# EAGLE design nixie_temp_clock (EAGLE 9.1.1)
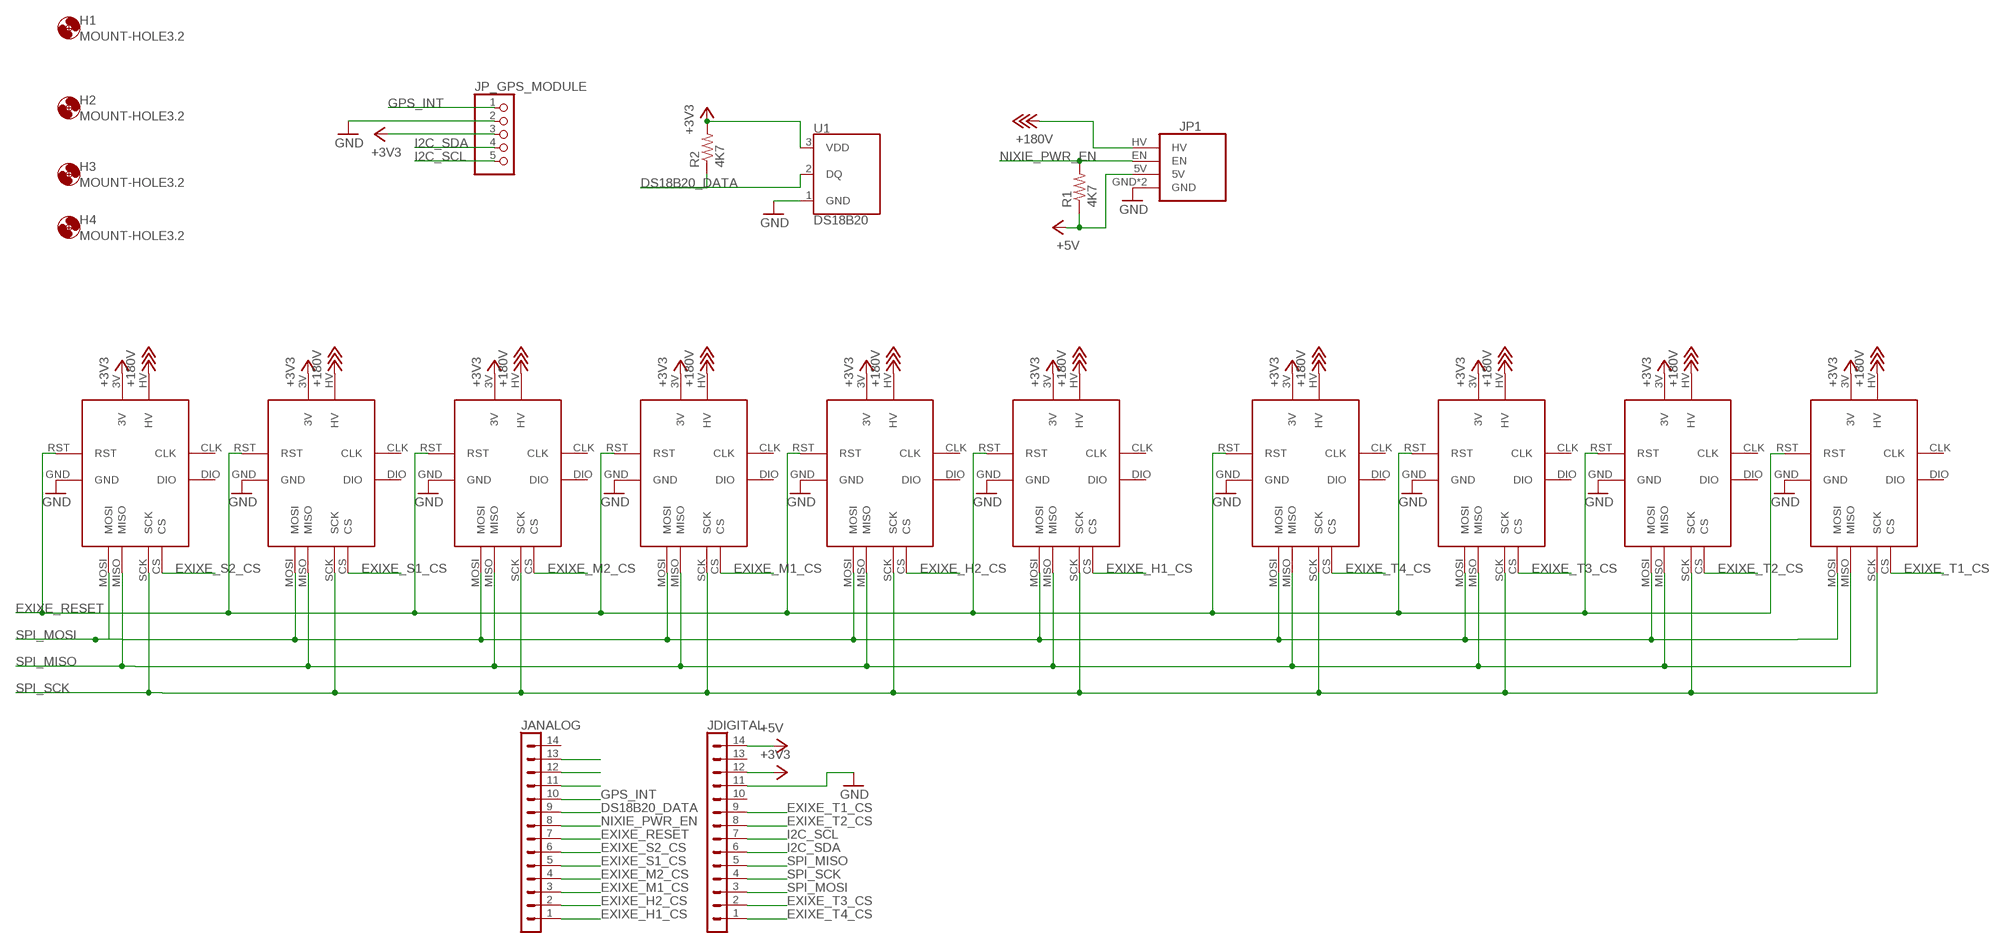
[diagram p0: schematic, sheet 1]

## Parts
EXIXE_H1  EXIXE_MODULE_EXIXE  [EXIXE_MODULE_EXIXE_PAC]
EXIXE_H2  EXIXE_MODULE_EXIXE  [EXIXE_MODULE_EXIXE_PAC]
EXIXE_M1  EXIXE_MODULE_EXIXE  [EXIXE_MODULE_EXIXE_PAC]
EXIXE_M2  EXIXE_MODULE_EXIXE  [EXIXE_MODULE_EXIXE_PAC]
EXIXE_S1  EXIXE_MODULE_EXIXE  [EXIXE_MODULE_EXIXE_PAC]
EXIXE_S2  EXIXE_MODULE_EXIXE  [EXIXE_MODULE_EXIXE_PAC]
EXIXE_T1  EXIXE_MODULE_EXIXE  [EXIXE_MODULE_EXIXE_PAC]
EXIXE_T2  EXIXE_MODULE_EXIXE  [EXIXE_MODULE_EXIXE_PAC]
EXIXE_T3  EXIXE_MODULE_EXIXE  [EXIXE_MODULE_EXIXE_PAC]
EXIXE_T4  EXIXE_MODULE_EXIXE  [EXIXE_MODULE_EXIXE_PAC]
H1  MOUNT-HOLE3.2  [3,2]
H2  MOUNT-HOLE3.2  [3,2]
H3  MOUNT-HOLE3.2  [3,2]
H4  MOUNT-HOLE3.2  [3,2]
JANALOG  ARDUINO-CONNECTORS_PINHD-1X14-SMTH  [ARDUINO-CONNECTORS_1X14]
JDIGITAL  ARDUINO-CONNECTORS_PINHD-1X14-SMTH  [ARDUINO-CONNECTORS_1X14]
JP1  EBAY_MODULETAOBAO  [TAOBAO_PKG]
JP_GPS_MODULE  PINHD-1X5  [1X05]
R1  4K7  R-US_0207/15  [0207/15]
R2  4K7  R-US_0207/15  [0207/15]
U1  DS18B20  [TO-92-AMMO]

## Nets
+3V3: EXIXE_H1.3V EXIXE_H2.3V EXIXE_M1.3V EXIXE_M2.3V EXIXE_S1.3V EXIXE_S2.3V EXIXE_T1.3V EXIXE_T2.3V EXIXE_T3.3V EXIXE_T4.3V JDIGITAL.12 JP_GPS_MODULE.3 R2.2 U1.3(VDD)
+5V: JDIGITAL.14 JP1.5V R1.1
+180V: EXIXE_H1.HV EXIXE_H2.HV EXIXE_M1.HV EXIXE_M2.HV EXIXE_S1.HV EXIXE_S2.HV EXIXE_T1.HV EXIXE_T2.HV EXIXE_T3.HV EXIXE_T4.HV JP1.HV
DS18B20_DATA: JANALOG.9 R2.1 U1.2(DQ)
EXIXE_H1_CS: EXIXE_S2.CS JANALOG.1
EXIXE_H2_CS: EXIXE_S1.CS JANALOG.2
EXIXE_M1_CS: EXIXE_M2.CS JANALOG.3
EXIXE_M2_CS: EXIXE_M1.CS JANALOG.4
EXIXE_RESET: EXIXE_H1.RST EXIXE_H2.RST EXIXE_M1.RST EXIXE_M2.RST EXIXE_S1.RST EXIXE_S2.RST EXIXE_T1.RST EXIXE_T2.RST EXIXE_T3.RST EXIXE_T4.RST JANALOG.7
EXIXE_S1_CS: EXIXE_H2.CS JANALOG.5
EXIXE_S2_CS: EXIXE_H1.CS JANALOG.6
EXIXE_T1_CS: EXIXE_T4.CS JDIGITAL.9
EXIXE_T2_CS: EXIXE_T3.CS JDIGITAL.8
EXIXE_T3_CS: EXIXE_T2.CS JDIGITAL.2
EXIXE_T4_CS: EXIXE_T1.CS JDIGITAL.1
GND: EXIXE_H1.GND EXIXE_H2.GND EXIXE_M1.GND EXIXE_M2.GND EXIXE_S1.GND EXIXE_S2.GND EXIXE_T1.GND EXIXE_T2.GND EXIXE_T3.GND EXIXE_T4.GND JDIGITAL.11 JP1.GND JP1.GND2(GND) JP_GPS_MODULE.2 U1.1(GND)
GPS_INT: JANALOG.10 JP_GPS_MODULE.1
I2C_SCL: JDIGITAL.7 JP_GPS_MODULE.5
I2C_SDA: JDIGITAL.6 JP_GPS_MODULE.4
N$11: JANALOG.11
N$12: JANALOG.12
N$13: JANALOG.13
NIXIE_PWR_EN: JANALOG.8 JP1.EN R1.2
SPI_MISO: EXIXE_H1.MISO EXIXE_H2.MISO EXIXE_M1.MISO EXIXE_M2.MISO EXIXE_S1.MISO EXIXE_S2.MISO EXIXE_T1.MISO EXIXE_T2.MISO EXIXE_T3.MISO EXIXE_T4.MISO JDIGITAL.5
SPI_MOSI: EXIXE_H1.MOSI EXIXE_H2.MOSI EXIXE_M1.MOSI EXIXE_M2.MOSI EXIXE_S1.MOSI EXIXE_S2.MOSI EXIXE_T1.MOSI EXIXE_T2.MOSI EXIXE_T3.MOSI EXIXE_T4.MOSI JDIGITAL.3
SPI_SCK: EXIXE_H1.SCK EXIXE_H2.SCK EXIXE_M1.SCK EXIXE_M2.SCK EXIXE_S1.SCK EXIXE_S2.SCK EXIXE_T1.SCK EXIXE_T2.SCK EXIXE_T3.SCK EXIXE_T4.SCK JDIGITAL.4
Unconnected: EXIXE_H1.CLK EXIXE_H1.DIO EXIXE_H2.CLK EXIXE_H2.DIO EXIXE_M1.CLK EXIXE_M1.DIO EXIXE_M2.CLK EXIXE_M2.DIO EXIXE_S1.CLK EXIXE_S1.DIO EXIXE_S2.CLK EXIXE_S2.DIO EXIXE_T1.CLK EXIXE_T1.DIO EXIXE_T2.CLK EXIXE_T2.DIO EXIXE_T3.CLK EXIXE_T3.DIO EXIXE_T4.CLK EXIXE_T4.DIO JANALOG.14 JDIGITAL.10 JDIGITAL.13

## Library data of the parts
EXIXE_H1 EXIXE_H2 EXIXE_M1 EXIXE_M2 EXIXE_S1 EXIXE_S2 EXIXE_T1-EXIXE_T4 = clock:EXIXE_MODULE_EXIXE: Exixe module from https://github.com/dekuNukem/exixe_clock
H1-H4 = holes:MOUNT-HOLE: MOUNTING HOLE with drill center marker
JANALOG JDIGITAL = MKRFoxShield_v2:ARDUINO-CONNECTORS_PINHD-1X14-SM: PIN HEADER; DATASHEET: -; DISTRIBUTOR-PN: -; MANUFACTURER: ELDECO; MANUFACTURER-PN: FH254114DF08500T
JP1 = nixie_power:EBAY_MODULE: PIN HEADER
JP_GPS_MODULE = pinhead:PINHD-1X5: PIN HEADER
R1 R2 = resistor:R-US_: RESISTOR, American symbol
U1 = SparkFun-Sensors:DS18B20: Dallas/Maxim DS18B20 1-Wire Temperature Sensor The DS18B20 reports degrees C with 9 to 12-bit precision, -55C to 125C (+/-0.5C). Each sensor has a unique 64-Bit Serial number etched into it - allows for a huge number of sensors to be used on one data bus. Datasheet <http://datasheets.maximintegrated.com/en/ds/DS18B20.pdf> SparkFun Products One Wire Digital Temperature Sensor - DS18B20 <https://www.sparkfun.com/products/245> (SEN-00245); STORE_ID: SEN-00245

## Board
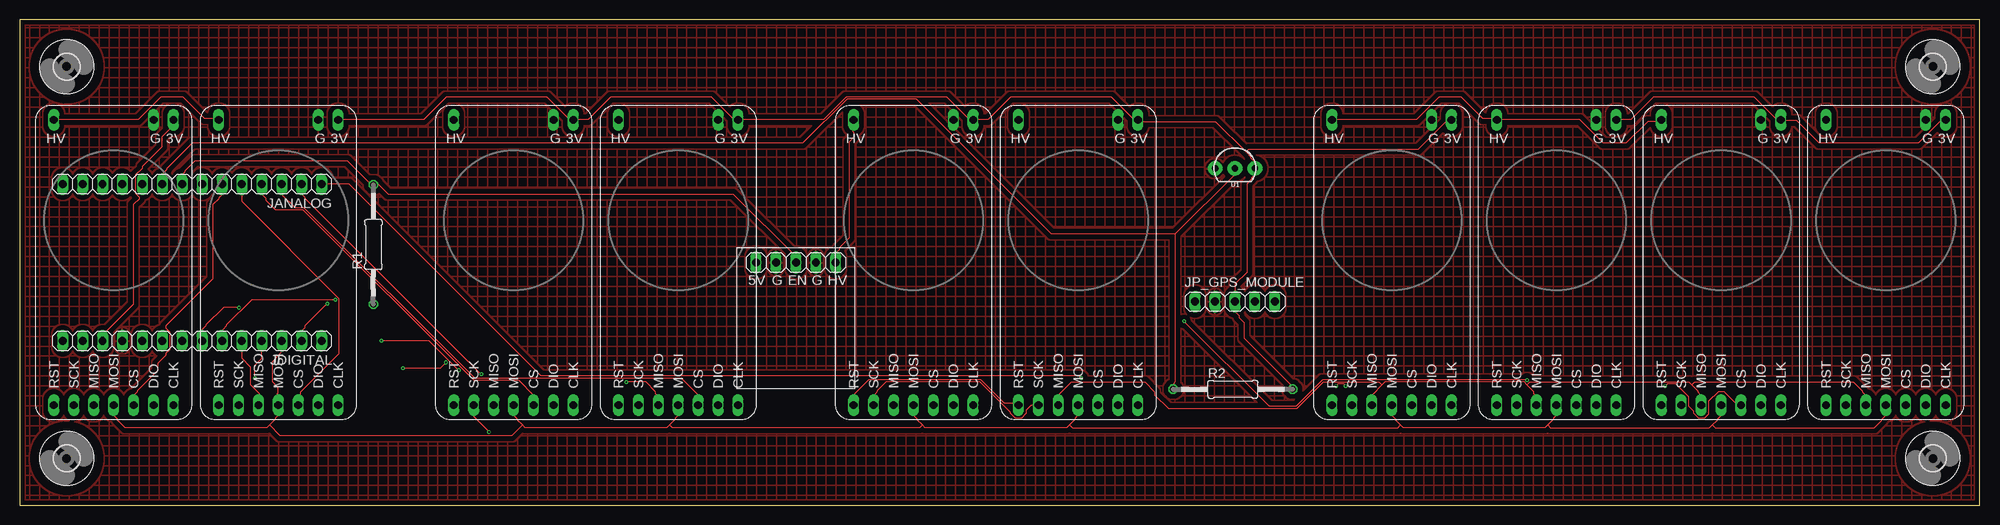
[diagram p1: board, top side]
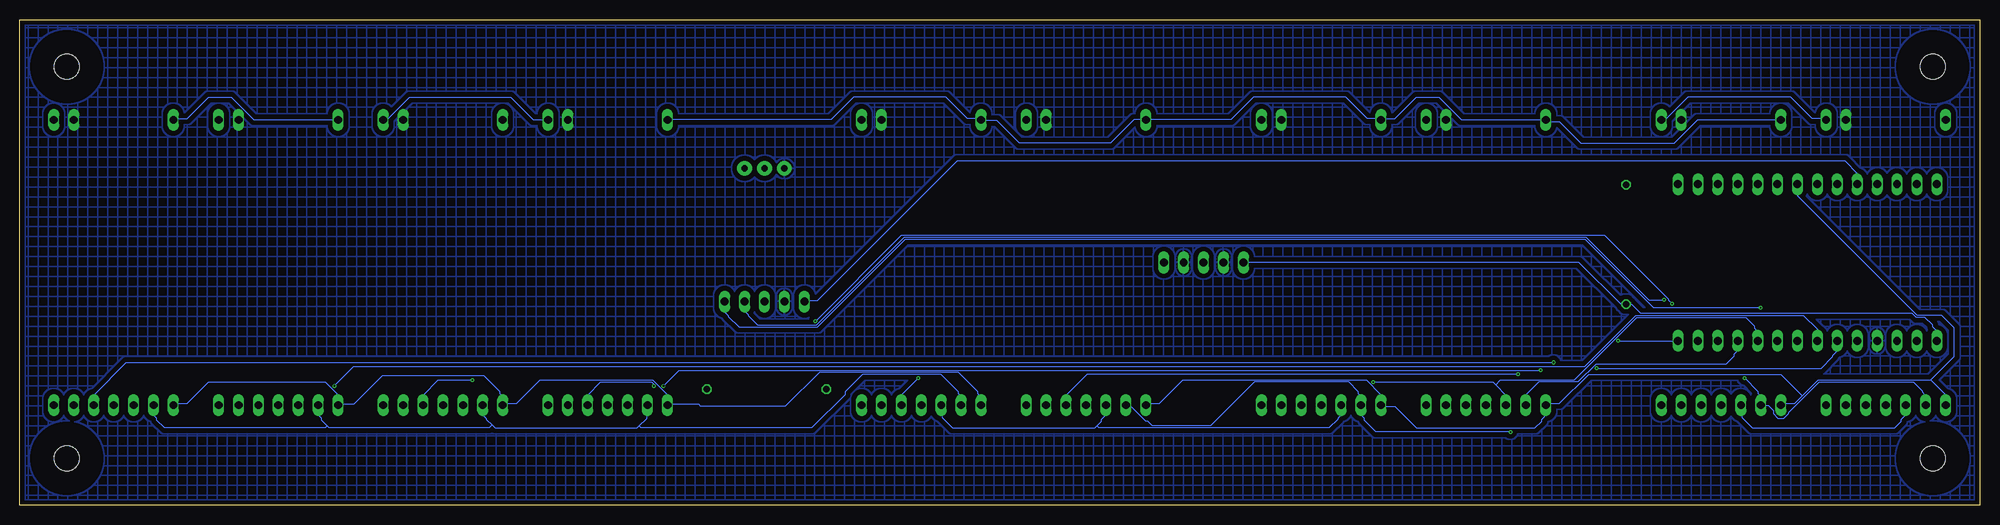
[diagram p2: board, bottom side, seen from below]

Size 250 x 62 mm. Coordinates in mm from the lower left corner, seen from the top.
Outline: 0,0 250,0 250,62 0,62 0,0
Copper layers (1*16): Top 0.035mm / dielectric 1.5mm / Bottom 0.035mm
Design rules "PCB-POOL HighSpec": minimum track width 0.125mm, minimum drill 0.2mm, track to track 0.125mm, track to pad 0.125mm, pad to pad 0.125mm, via to via 0.125mm, smd to smd 0.125mm, copper to edge 0.3mm, drill to drill 0.2mm, minimum pad ring 0.2mm, minimum via ring 0.125mm, stop-mask expansion 0.075mm, vias tented up to drill 0mil, thermal gap 0.2mm

### Footprints (pad centres in the part's own frame; a part is rotated, then mirrored left to right if it is on the bottom)
EXIXE_MODULE_EXIXE_PAC = drill 1.016 long: 3V 17.62,38.2; CLK 17.62,1.8; CS 12.54,1.8; DIO 15.08,1.8; GND 15.08,38.2; HV 2.38,38.2; MISO 7.46,1.8; MOSI 10,1.8; RST 2.38,1.8; SCK 4.92,1.8
3,2 = hole 3.2: 0,0
ARDUINO-CONNECTORS_1X14 = drill 1.016 long: 1 -16.51,0; 2 -13.97,0; 3 -11.43,0; 4 -8.89,0; 5 -6.35,0; 6 -3.81,0; 7 -1.27,0; 8 1.27,0; 9 3.81,0; 10 6.35,0; 11 8.89,0; 12 11.43,0; 13 13.97,0; 14 16.51,0
TAOBAO_PKG = drill 1.016 long: 5V -5.08,0; EN 0,0; GND 2.54,0; GND2 -2.54,0; HV 5.08,0
1X05 = drill 1.016 long: 1 -5.08,0; 2 -2.54,0; 3 0,0; 4 2.54,0; 5 5.08,0
0207/15 = drill 0.813 octagon: 1 -7.62,0; 2 7.62,0
TO-92-AMMO = drill 0.813 pad 1.88: 1 -2.54,0; 2 0,0; 3 2.54,0

### Placement (x,y rotation side)
EXIXE_H1  2,11 0 top
EXIXE_H2  23,11 0 top
EXIXE_M1  53,11 0 top
EXIXE_M2  74,11 0 top
EXIXE_S1  104,11 0 top
EXIXE_S2  125,11 0 top
EXIXE_T1  165,11 0 top
EXIXE_T2  186,11 0 top
EXIXE_T3  207,11 0 top
EXIXE_T4  228,11 0 top
H1  6,6 0 top
H2  6,56 0 top
H3  244,6 0 top
H4  244,56 0 top
JANALOG  22,41 180 top
JDIGITAL  22,21 180 top
JP1  99,31 0 top
JP_GPS_MODULE  155,26 0 top
R1  45.12,33.3 90 top
R2  154.73,14.82 0 top
U1  155,43 0 top

### Tracks (layer width: path | path; a pad name or v marks a point on that pad's centre or on a via)
+3V3
  Top 0.125: EXIXE_T4.3V 245.5,49.12 245,49.12 242.12,46.25 229.5,46.25 226.62,49.12 224.62,49.12 EXIXE_T3.3V 224.5,49.25 224.12,49.25 221.25,52.12 208.38,52.12 205.5,49.25 203.62,49.25 EXIXE_T2.3V | JDIGITAL.12 10.62,21 10.62,21.75 14.5,25.62 14.5,38.38 15.25,39.12 15.25,39.38 14.75,39.88 14.75,42.12 15.62,43 15.62,43.25 18.12,45.75 18.12,47 19.5,48.38 19.5,49.12 EXIXE_H1.3V | R2.2 162.25,14.88 162.25,15.25 156.12,21.38 156.12,23.38 155.5,24 155.5,24.25 155,24.75 JP_GPS_MODULE.3 155,28.25 156.5,29.75 156.5,41 157.12,41.62 157.12,41.75 157.5,42.12 157.5,43 | 157.5,43 157.5,43.88 157,44.38 157,44.5 156.38,45.12 | 156.38,45.12 152.5,49 142.75,49 142.62,49.12 EXIXE_S2.3V 142.5,49.25 142.12,49.25 139.25,52.12 126.38,52.12 123.5,49.25 121.62,49.25 EXIXE_S1.3V 121.5,49.25 121.12,49.25 118.25,52.12 105.38,52.12 102.5,49.25 91.62,49.25 EXIXE_M2.3V 91.5,49.25 91.12,49.25 88.25,52.12 75.38,52.12 72.5,49.25 70.62,49.25 EXIXE_M1.3V 70.5,49.25 70.12,49.25 67.25,52.12 54.38,52.12 51.5,49.25 40.62,49.25 EXIXE_H2.3V | 157.5,43 U1.3 157.5,43 | 156.38,45.12 156.75,45.5 178.38,45.5 182,49.12 182.5,49.12 EXIXE_T1.3V
  Bottom 0.125: EXIXE_T1.3V 182.62,49.25 184.5,49.25 187.38,52.12 200.25,52.12 203.12,49.25 203.5,49.25 EXIXE_T2.3V | EXIXE_H2.3V 40.5,49.25 40.12,49.25 37.25,52.12 24.12,52.12 21.38,49.38 19.75,49.38 19.62,49.25 EXIXE_H1.3V
+5V
  Bottom 0.125: JDIGITAL.14 5.5,22.25 6,22.75 6,23 7,24 8.12,24 8.62,24.5 43.25,24.5 44.38,25.62 45,25.62 R1.1 45.12,25.62 45.75,25.62 51.12,31 93.88,31 JP1.5V
+180V
  Top 0.125: EXIXE_T1.HV 167.5,49.25 178.12,49.25 181,52.12 183.88,52.12 186.62,49.38 188.25,49.38 188.38,49.25 EXIXE_T2.HV 188.5,49.25 199,49.25 202,46.25 204.88,46.25 207.62,49 209.25,49 209.38,49.12 EXIXE_T3.HV | JP1.HV 104.12,31 104.12,32.25 104.5,32.62 104.5,32.88 105.75,34.12 105.75,46.38 106.38,47 106.38,47.62 106.25,47.75 106.25,49 106.38,49.12 EXIXE_S1.HV | EXIXE_H1.HV 4.5,49.25 15.12,49.25 18,52.12 20.88,52.12 23.62,49.38 25.25,49.38 25.38,49.25 EXIXE_H2.HV
  Bottom 0.125: EXIXE_T3.HV 209.5,49.25 220.12,49.25 223,52.12 225.88,52.12 228.62,49.38 230.25,49.38 230.38,49.25 EXIXE_T4.HV | EXIXE_H2.HV 25.5,49.25 36,49.25 39,46.25 50.88,46.25 53.62,49 55.25,49 55.38,49.12 EXIXE_M1.HV 55.5,49.25 66.12,49.25 69,52.12 71.88,52.12 74.62,49.38 76.25,49.38 76.38,49.25 EXIXE_M2.HV 76.5,49.25 76.62,49.38 78.12,49.38 80.88,52.12 92.62,52.12 95.5,49.25 106.38,49.25 EXIXE_S1.HV 106.5,49.25 107.88,49.25 110.88,46.25 122.5,46.25 125.38,49.12 127.38,49.12 EXIXE_S2.HV 127.5,49.25 127.62,49.38 129.12,49.38 131.88,52.12 143.62,52.12 146.5,49.25 167.38,49.25 EXIXE_T1.HV
DS18B20_DATA
  Top 0.125: 147.38,34.62 147.38,15.75 147.12,15.5 147.12,14.88 R2.1 | 147.38,34.62 155,42.25 U1.2 | 147.38,34.62 131.62,34.62 114.38,51.88 105.5,51.88 99.88,46.25 22,46.25 18.75,43 18.75,42.88 18.25,42.38 18.25,41 JANALOG.9
EXIXE_H1_CS  (via drill 0.2)
  Top 0.125: v135.38,16.25 135.12,16.5 66.5,16.5 42,41 38.62,41 JANALOG.1
  Bottom 0.125: v135.38,16.25 137.5,14.12 137.5,12.88 EXIXE_S2.CS
EXIXE_H2_CS  (via drill 0.2)
  Top 0.125: v58.88,16.75 36.38,39.25 36.38,39.38 36,39.75 36,41 JANALOG.2
  Bottom 0.125: v58.88,16.75 113.88,16.75 116.5,14.12 116.5,12.88 EXIXE_S1.CS
EXIXE_M1_CS
  Top 0.125: EXIXE_M2.CS 86.5,12.88 86.5,14.12 84.38,16.25 58,16.25 36.25,38 35.12,38 33.5,39.62 33.5,41 JANALOG.3
EXIXE_M2_CS
  Top 0.125: EXIXE_M1.CS 65.5,12.88 65.5,14.12 63.62,16 57.88,16 36.12,37.75 32.62,37.75 31.38,39 31.38,39.25 31,39.62 31,41 JANALOG.4
EXIXE_RESET
  Top 0.125: EXIXE_S1.RST 106.5,12.88 106.5,14.25 108.25,16 122.62,16 125.62,13 127.25,13 127.38,12.88 EXIXE_S2.RST
  Bottom 0.125: EXIXE_T4.RST 230.38,12.88 230.25,13 228.62,13 225.88,15.75 211,15.75 209.5,14.25 209.5,12.88 EXIXE_T3.RST 209.38,12.88 207.38,12.88 203.75,16.5 190.75,16.5 188.75,14.5 188.75,14.25 188.25,13.75 188.25,13 | 188.25,13 186.62,13 183.62,16 169.25,16 167.5,14.25 167.5,12.88 EXIXE_T1.RST 167.38,12.88 163.38,12.88 163.12,12.62 152.38,12.62 148,17 130.25,17 127.75,14.5 127.75,14.25 127.5,14 127.5,12.88 EXIXE_S2.RST | 188.25,13 188.38,12.88 EXIXE_T2.RST 188.25,13 | 6.25,16 4.5,14.25 4.5,12.88 EXIXE_H1.RST | 6.25,16 20.62,16 22.62,14 | 22.62,14 23.62,13 25.25,13 25.38,12.88 EXIXE_H2.RST | 6.25,16 3.25,19 3.25,22.62 4.88,24.25 8,24.25 23.25,39.5 23.25,41 JANALOG.7 | EXIXE_S1.RST 106.38,12.88 106.25,13 104.62,13 101.62,16 78.25,16 76.5,14.25 76.5,12.88 EXIXE_M2.RST 76.38,12.75 76.25,12.62 74.62,12.62 71.88,9.88 56.75,9.88 55.88,10.75 55.88,11 55.5,11.38 55.5,12.75 EXIXE_M1.RST 55.38,12.88 55.25,13 53.62,13 49.88,16.75 25.38,16.75 22.62,14
EXIXE_S1_CS
  Top 0.125: JANALOG.5 28.38,41 28.38,38.75 40.75,26.38 40.75,19.38 35.88,14.5 35.88,14.25 35.62,14 35.62,12.88 EXIXE_H2.CS
EXIXE_S2_CS
  Top 0.125: EXIXE_H1.CS 14.62,12.88 14.62,14.12 15,14.5 15,14.62 17.62,17.25 17.62,18.12 18.62,19.12 18.62,19.38 19.12,19.88 19.12,22.12 18.62,22.62 18.62,22.88 24.62,28.88 24.62,38.38 25.38,39.12 25.38,39.25 25.75,39.62 25.75,41 JANALOG.6
EXIXE_T1_CS  (via drill 0.2)
  Top 0.125: v48.88,17.5 53.62,17.5 v54.38,18.25
  Bottom 0.125: v48.88,17.5 20.25,17.5 18.75,19 18.75,19.12 18.25,19.62 18.25,21 JDIGITAL.9 | v54.38,18.25 236.38,18.25 240.5,14.12 240.5,12.88 EXIXE_T4.CS
EXIXE_T2_CS  (via drill 0.2)
  Top 0.125: v209.88,15.25 210.12,15.5 211.25,15.5 212.88,13.88 212.88,12.62 213.5,12 213.5,11.75 214.12,11.12 214.88,11.12 215.38,11.62 215.38,13.25 216.62,14.5 217.38,14.5 219,12.88 219.5,12.88 EXIXE_T3.CS
  Bottom 0.125: v209.88,15.25 207.38,17.75 50.38,17.75 43.88,24.25 22.5,24.25 20.75,22.5 20.75,21 JDIGITAL.8
EXIXE_T3_CS  (via drill 0.2)
  Top 0.125: v39.25,25.75 36.38,22.88 36.38,22.62 36,22.25 36,21 JDIGITAL.2 | v148.5,23.5 159.38,12.62 162.75,12.62 166.12,16 v192.25,16
  Bottom 0.125: v39.25,25.75 39.75,26.25 39.75,26.38 47.88,34.5 137.5,34.5 v148.5,23.5 | v192.25,16 196.62,16 198.5,14.12 198.5,12.88 EXIXE_T2.CS
EXIXE_T4_CS  (via drill 0.2)
  Top 0.125: v46.12,21 52.25,21 v56,17.25 | v167.88,15.25 168.12,15.5 168.88,15.5 v169.12,15.25
  Bottom 0.125: v46.12,21 38.62,21 JDIGITAL.1 | v56,17.25 165.88,17.25 v167.88,15.25 | v169.12,15.25 169.12,15.5 169.38,15.75 175.88,15.75 177.5,14.12 177.5,12.88 EXIXE_T1.CS
GND
  pour Top (isolate 0.61, hatched): 0,0 0,62 250,62 250,0
  pour Bottom (isolate 0.61, hatched): 0,0 0,62 250,62 250,0
GPS_INT
  Bottom 0.125: JANALOG.10 15.62,41 15.62,42.38 17.25,44 130.38,44 148.25,26.12 149.75,26.12 149.88,26 JP_GPS_MODULE.1
I2C_SCL  (via drill 0.2)
  Top 0.125: v28,25.25 26,25.25 23.75,23 23.75,22.88 23.25,22.38 23.25,21 JDIGITAL.7
  Bottom 0.125: v28,25.25 41.62,25.25 50.38,34 137,34 148.25,22.75 158.25,22.75 159.62,24.12 159.62,24.25 160,24.62 160,26 JP_GPS_MODULE.5
I2C_SDA  (via drill 0.2)
  Top 0.125: v40.25,26.25 29.62,26.25 26.38,23 26.38,22.88 25.88,22.38 25.88,21 JDIGITAL.6
  Bottom 0.125: v40.25,26.25 42.25,26.25 50.25,34.25 137.12,34.25 148.38,23 155.88,23 157.12,24.25 157.12,24.38 157.5,24.75 157.5,26 JP_GPS_MODULE.4
NIXIE_PWR_EN
  Top 0.125: JANALOG.8 20.75,41 20.75,42.25 21.12,42.62 21.12,42.75 22.38,44 41.75,44 44.75,41 45,41 R1.2 45.12,41 45.75,41 47,39.75 91,39.75 99,31.75 JP1.EN
SPI_MISO  (via drill 0.2)
  Top 0.125: 173.75,15.38 174.12,15.75 191.88,15.75 192.25,15.38 | 173.75,15.38 172.5,14.12 172.5,12.88 EXIXE_T1.MISO | 192.25,15.38 193.12,14.5 193.12,14.25 193.38,14 193.38,12.88 EXIXE_T2.MISO | 213.25,15.38 212.88,15.75 192.62,15.75 192.25,15.38 | 213.25,15.38 214,14.62 214,14.5 214.38,14.12 214.38,12.88 EXIXE_T3.MISO | 213.25,15.38 213.62,15.75 233.88,15.75 235,14.62 235,14.5 235.38,14.12 235.38,12.88 EXIXE_T4.MISO | JDIGITAL.5 28.38,21 28.38,18.75 29.5,17.62 29.5,15.38 30.62,14.25 30.62,13 30.5,12.88 EXIXE_H2.MISO | v77.38,15.75 79.88,15.75 81.12,14.5 81.12,14.25 81.38,14 81.38,12.88 EXIXE_M2.MISO | 173.75,15.38 173.38,15.75 166.25,15.75 162.88,12.38 146.5,12.38 144.75,14.12 144.75,14.5 143.5,15.75 134.12,15.75 132.5,14.12 132.5,12.88 EXIXE_S2.MISO
  Bottom 0.125: EXIXE_H1.MISO 9.5,12.75 9.5,11.5 10,11 10,10.75 10.88,9.88 29,9.88 30.38,11.25 30.38,12.75 EXIXE_H2.MISO | 112.62,10.12 112.88,9.88 131,9.88 132.38,11.25 132.38,12.75 EXIXE_S2.MISO | 112.62,10.12 112,10.75 112,11 111.5,11.5 111.5,12.75 EXIXE_S1.MISO | 61.75,15.38 62.12,15.75 v77.38,15.75 | 61.75,15.38 60.5,14.12 60.5,12.88 EXIXE_M1.MISO | 112.62,10.12 112.38,9.88 83,9.88 81.88,11 81.88,11.12 81.5,11.5 81.5,12.75 EXIXE_M2.MISO | 61.75,15.38 61.12,16 51.75,16 43.75,24 29.88,24 28.75,22.88 28.75,22.62 28.38,22.25 28.38,21 JDIGITAL.5
SPI_MOSI
  Top 0.125: 176.12,10.25 176.5,9.88 194.5,9.88 194.88,10.25 | 176.12,10.25 175.5,10.88 175.5,11 175,11.5 175,12.75 EXIXE_T1.MOSI | 194.88,10.25 195.62,11 195.62,11.12 196,11.5 196,12.75 EXIXE_T2.MOSI | 215.88,10.25 215.5,9.88 195.25,9.88 194.88,10.25 | 215.88,10.25 216.5,10.88 216.5,11 217,11.5 217,12.75 EXIXE_T3.MOSI | 215.88,10.25 216.25,9.88 236.5,9.88 237.5,10.88 237.5,11 238,11.5 238,12.75 EXIXE_T4.MOSI | 31.88,10.25 32.62,11 32.62,11.12 33,11.5 33,12.75 EXIXE_H2.MOSI 33,12.88 32.88,13 32.88,14.25 33,14.38 33,15 32.25,15.75 32.25,18.38 33.38,19.5 33.38,21 JDIGITAL.3 | 31.88,10.25 31.5,9.88 13.5,9.88 12.5,10.88 12.5,11 12,11.5 12,12.75 EXIXE_H1.MOSI | 64.12,10.25 64.5,9.88 82.5,9.88 82.88,10.25 | 64.12,10.25 63.5,10.88 63.5,11 63,11.5 63,12.75 EXIXE_M1.MOSI | 82.88,10.25 83.62,11 83.62,11.12 84,11.5 84,12.75 EXIXE_M2.MOSI | 115.12,10.25 115.5,9.88 133.5,9.88 133.88,10.25 | 115.12,10.25 114.5,10.88 114.5,11 114,11.5 114,12.75 EXIXE_S1.MOSI | 133.88,10.25 134.62,11 134.62,11.12 135,11.5 135,12.75 EXIXE_S2.MOSI | 82.88,10.25 83.25,9.88 114.75,9.88 115.12,10.25 | 31.88,10.25 33.25,8.88 62.75,8.88 64.12,10.25 | 176.12,10.25 175.75,9.88 134.25,9.88 133.88,10.25
SPI_SCK  (via drill 0.2)
  Top 0.125: EXIXE_S1.SCK 109,12.88 109,14.12 109.38,14.5 109.38,14.62 110.5,15.75 122.5,15.75 126.38,11.88 126.38,11.75 127,11.12 127.75,11.12 128.38,11.75 128.38,12.12 129,12.75 129.88,12.75 EXIXE_S2.SCK | v30,16.25 30,17.88 30.88,18.75 30.88,21 JDIGITAL.4 | v59.88,9.38 57.88,11.38 57.88,12.75 EXIXE_M1.SCK
  Bottom 0.125: 171,10.12 171.25,9.88 189.38,9.88 189.75,10.25 | 171,10.12 170,11.12 170,12.75 EXIXE_T1.SCK | 189.75,10.25 190.5,11 190.5,11.12 190.88,11.5 190.88,12.75 EXIXE_T2.SCK | 210.75,10.12 210.5,9.88 190.12,9.88 189.75,10.25 | 210.75,10.12 211.5,10.88 211.5,11.12 211.88,11.5 211.88,12.75 EXIXE_T3.SCK | 210.75,10.12 211,9.88 231.5,9.88 232.5,10.88 232.5,11.12 232.88,11.5 232.88,12.75 EXIXE_T4.SCK | EXIXE_H1.SCK 7,12.88 7,14.12 7.38,14.5 7.38,14.62 8.5,15.75 20.5,15.75 24.38,11.88 24.38,11.75 25,11.12 25.75,11.12 26.38,11.75 26.38,12.12 27,12.75 27.88,12.75 EXIXE_H2.SCK 28,12.88 28,14 28.25,14.25 28.25,14.5 v30,16.25 | EXIXE_M1.SCK 57.88,12.88 57.88,14.12 56.25,15.75 51.25,15.75 49,18 32.38,18 31.38,19 31.38,19.25 31,19.62 31,21 JDIGITAL.4 | v59.88,9.38 77,9.38 78.5,10.88 78.5,11.12 78.88,11.5 78.88,12.75 EXIXE_M2.SCK 79,12.88 79,14 79.25,14.25 79.25,14.5 80.5,15.75 92.5,15.75 98.12,10.12 105.5,10.12 106.12,10.75 106.38,10.75 108.38,12.75 108.88,12.75 EXIXE_S1.SCK | 171,10.12 170.75,9.88 149,9.88 144.75,14.12 144.75,14.5 142.5,16.75 132.5,16.75 130.25,14.5 130.25,14.25 130,14 130,12.88 EXIXE_S2.SCK